# EAGLE schematic Controller (EAGLE 6.5.0)
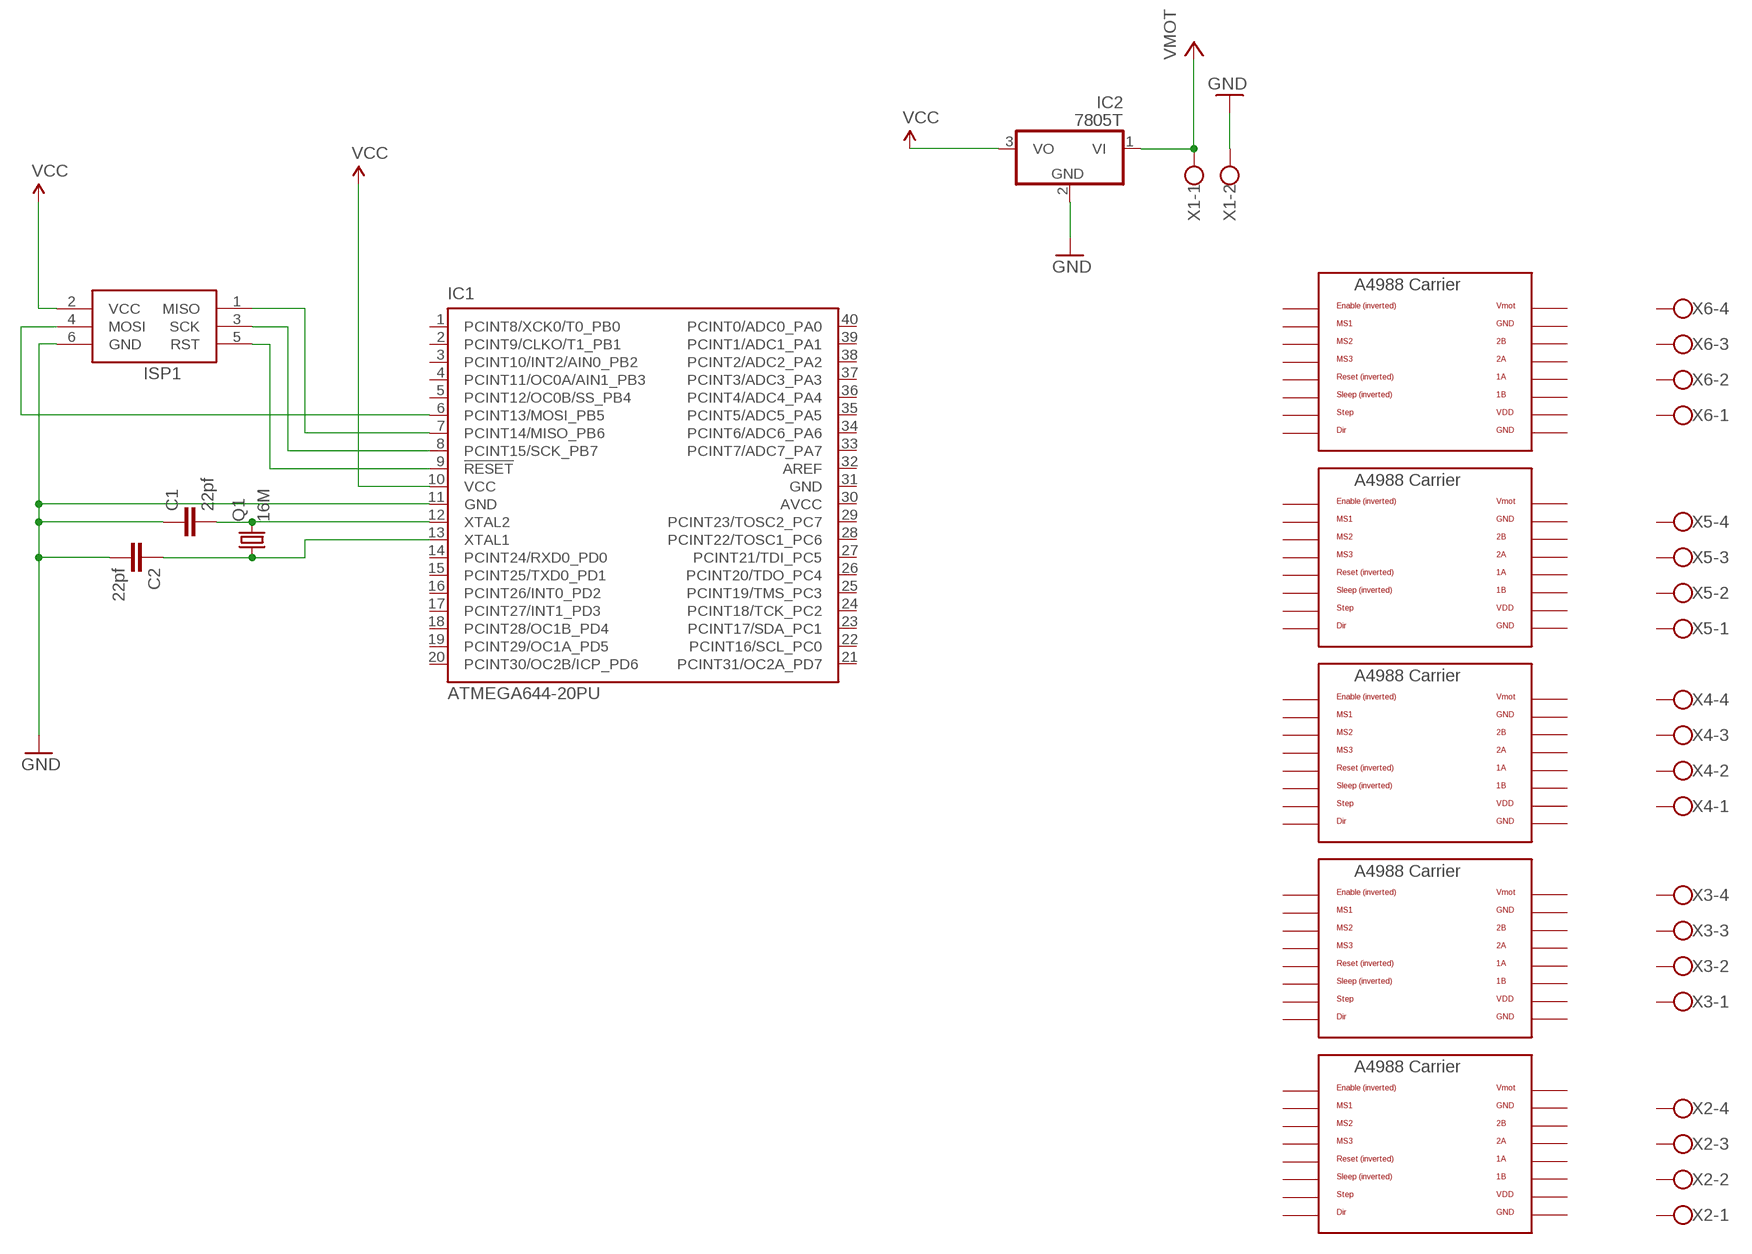
[diagram p0: schematic, sheet 1]

## Parts
C1  22pf  CAPPTH  [CAP-PTH-SMALL]
C2  22pf  CAPPTH  [CAP-PTH-SMALL]
IC1  ATMEGA644-20PU  [DIL40]
IC2  7805T  [TO220H]
ISP1  AVRISP-6  [AVRISP]
Q1  16M  CRYSTALHC49U-V  [HC49U-V]
U$1  A4988BREAKOUT  [A4988BREAKOUT]
U$2  A4988BREAKOUT  [A4988BREAKOUT]
U$3  A4988BREAKOUT  [A4988BREAKOUT]
U$4  A4988BREAKOUT  [A4988BREAKOUT]
U$5  A4988BREAKOUT  [A4988BREAKOUT]
X1  W237-102  [W237-102]
X2  W237-4  [W237-4]
X3  W237-4  [W237-4]
X4  W237-4  [W237-4]
X5  W237-4  [W237-4]
X6  W237-4  [W237-4]

## Nets
GND: C1.1 C2.2 IC1.11(GND) IC2.2(GND) ISP1.6(GND) X1.2
N$1: IC1.8(PCINT15/SCK_PB7) ISP1.3(SCK)
N$2: IC1.9(!RESET) ISP1.5(RST)
N$3: IC1.7(PCINT14/MISO_PB6) ISP1.1(MISO)
N$4: IC1.6(PCINT13/MOSI_PB5) ISP1.4(MOSI)
N$5: IC2.1(VI) X1.1 ; supply symbol labelled VMOT
N$7: C1.2 IC1.12(XTAL2) Q1.2
N$8: C2.1 IC1.13(XTAL1) Q1.1
VCC: IC1.10(VCC) IC2.3(VO) ISP1.2(VCC)
Unconnected: IC1.1(PCINT8/XCK0/T0_PB0) IC1.2(PCINT9/CLKO/T1_PB1) IC1.3(PCINT10/INT2/AIN0_PB2) IC1.4(PCINT11/OC0A/AIN1_PB3) IC1.5(PCINT12/OC0B/SS_PB4) IC1.14(PCINT24/RXD0_PD0) IC1.15(PCINT25/TXD0_PD1) IC1.16(PCINT26/INT0_PD2) IC1.17(PCINT27/INT1_PD3) IC1.18(PCINT28/OC1B_PD4) IC1.19(PCINT29/OC1A_PD5) IC1.20(PCINT30/OC2B/ICP_PD6) IC1.21(PCINT31/OC2A_PD7) IC1.22(PCINT16/SCL_PC0) IC1.23(PCINT17/SDA_PC1) IC1.24(PCINT18/TCK_PC2) IC1.25(PCINT19/TMS_PC3) IC1.26(PCINT20/TDO_PC4) IC1.27(PCINT21/TDI_PC5) IC1.28(PCINT22/TOSC1_PC6) IC1.29(PCINT23/TOSC2_PC7) IC1.32(AREF) IC1.33(PCINT7/ADC7_PA7) IC1.34(PCINT6/ADC6_PA6) IC1.35(PCINT5/ADC5_PA5) IC1.36(PCINT4/ADC4_PA4) IC1.37(PCINT3/ADC3_PA3) IC1.38(PCINT2/ADC2_PA2) IC1.39(PCINT1/ADC1_PA1) IC1.40(PCINT0/ADC0_PA0) U$1.1A U$1.1B U$1.2A U$1.2B U$1.DIR U$1.EN U$1.MS1 U$1.MS2 U$1.MS3 U$1.RST U$1.SLP(SLEEP) U$1.STEP U$2.1A U$2.1B U$2.2A U$2.2B U$2.DIR U$2.EN U$2.MS1 U$2.MS2 U$2.MS3 U$2.RST U$2.SLP(SLEEP) U$2.STEP U$3.1A U$3.1B U$3.2A U$3.2B U$3.DIR U$3.EN U$3.MS1 U$3.MS2 U$3.MS3 U$3.RST U$3.SLP(SLEEP) U$3.STEP U$4.1A U$4.1B U$4.2A U$4.2B U$4.DIR U$4.EN U$4.MS1 U$4.MS2 U$4.MS3 U$4.RST U$4.SLP(SLEEP) U$4.STEP U$5.1A U$5.1B U$5.2A U$5.2B U$5.DIR U$5.EN U$5.MS1 U$5.MS2 U$5.MS3 U$5.RST U$5.SLP(SLEEP) U$5.STEP X2.1 X2.2 X2.3 X2.4 X3.1 X3.2 X3.3 X3.4 X4.1 X4.2 X4.3 X4.4 X5.1 X5.2 X5.3 X5.4 X6.1 X6.2 X6.3 X6.4

## Power pins joined to a net without a drawn wire
AVCC: IC1.30(AVCC)
GND: IC1.31(GND) U$1.GND U$1.GND@0(GND) U$2.GND U$2.GND@0(GND) U$3.GND U$3.GND@0(GND) U$4.GND U$4.GND@0(GND) U$5.GND U$5.GND@0(GND)
VDD: U$1.VDD U$2.VDD U$3.VDD U$4.VDD U$5.VDD
VMOT: U$1.VMOT U$2.VMOT U$3.VMOT U$4.VMOT U$5.VMOT

## Library data of the parts
C1 C2 = SparkFun-Capacitors:CAP: Capacitor Standard 0603 ceramic capacitor, and 0.1" leaded capacitor.
IC1 = atmel:ATMEGA644-*PU: 8-bit Microcontroller with 64K Bytes In-System Programmable Flash Auto generated by make-symbol-device-package-bsdl.ulp Rev. 34 Source: http://www.atmel.com/dyn/resources/prod_documents/doc2593.pdf; MPN: ATMEGA644-20PU; OC_FARNELL: 1288340; OC_NEWARK: 23M5060
IC2 = adafruit:78*: Positive VOLTAGE REGULATOR Added bigger pads to the TO-92 package
ISP1 = adafruit:AVRISP: AVR ISP HEADER Standard 6 pin header for AVR programming
Q1 = adafruit:CRYSTAL: CRYSTAL; OC_FARNELL: 1666969; OC_NEWARK: unknown
U$1-U$5 = RepRapjr:A4988BREAKOUT
X1 = con-wago-500:W237-102: WAGO SCREW CLAMP; MPN: 237-102; OC_FARNELL: unknown; OC_NEWARK: 70K9898
X2-X6 = con-wago-500:W237-4: WAGO SCREW CLAMP; OC_FARNELL: unknown; OC_NEWARK: unknown